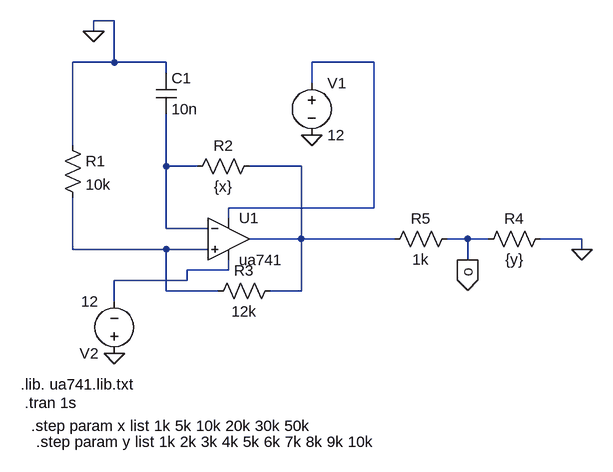
[diagram p0: schematic Square wave.asc]
Square wave.asc, the LTspice schematic file:
Version 4
SHEET 1 880 680
WIRE 48 -176 16 -176
WIRE 16 -160 16 -176
WIRE 48 -112 48 -176
WIRE 48 -112 -16 -112
WIRE 128 -112 48 -112
WIRE 448 -112 352 -112
WIRE 128 -96 128 -112
WIRE 352 -80 352 -112
WIRE -16 16 -16 -112
WIRE 128 48 128 -32
WIRE 176 48 128 48
WIRE 336 48 256 48
WIRE 448 112 448 -112
WIRE 448 112 224 112
WIRE 224 128 224 112
WIRE 128 144 128 48
WIRE 192 144 128 144
WIRE 336 160 336 48
WIRE 336 160 256 160
WIRE 480 160 336 160
WIRE 592 160 560 160
WIRE 624 160 592 160
WIRE 768 160 704 160
WIRE -16 176 -16 96
WIRE 128 176 -16 176
WIRE 192 176 128 176
WIRE 768 176 768 160
WIRE 592 192 592 160
WIRE 224 208 224 192
WIRE 224 208 160 208
WIRE 160 224 160 208
WIRE 160 224 48 224
WIRE 128 240 128 176
WIRE 208 240 128 240
WIRE 336 240 336 160
WIRE 336 240 288 240
WIRE 48 256 48 224
FLAG 16 -160 0
FLAG 48 336 0
FLAG 352 0 0
FLAG 768 176 0
FLAG 592 192 o
IOPIN 592 192 Out
SYMBOL res -32 0 R0
SYMATTR InstName R1
SYMATTR Value 10k
SYMBOL res 272 32 R90
WINDOW 0 0 56 VBottom 2
WINDOW 3 32 56 VTop 2
SYMATTR InstName R2
SYMATTR Value {x}
SYMBOL cap 112 -96 R0
SYMATTR InstName C1
SYMATTR Value 10n
SYMBOL res 304 224 R90
WINDOW 0 0 56 VBottom 2
WINDOW 3 32 56 VTop 2
SYMATTR InstName R3
SYMATTR Value 12k
SYMBOL voltage 352 -96 R0
WINDOW 123 0 0 Left 0
WINDOW 39 0 0 Left 0
SYMATTR InstName V1
SYMATTR Value 12
SYMBOL voltage 48 352 R180
WINDOW 123 0 0 Left 0
WINDOW 39 0 0 Left 0
SYMATTR InstName V2
SYMATTR Value 12
SYMBOL OpAmps\\ua741 224 96 R0
SYMATTR InstName U1
SYMBOL res 720 144 R90
WINDOW 0 0 56 VBottom 2
WINDOW 3 32 56 VTop 2
SYMATTR InstName R4
SYMATTR Value {y}
SYMBOL res 464 176 R270
WINDOW 0 32 56 VTop 2
WINDOW 3 0 56 VBottom 2
SYMATTR InstName R5
SYMATTR Value 1k
TEXT -90 412 Left 2 !.tran 1s
TEXT -96 384 Left 2 !.lib. ua741.lib.txt
TEXT -80 448 Left 2 !.step param x list 1k 5k 10k 20k 30k 50k
TEXT -72 472 Left 2 !.step param y list 1k 2k 3k 4k 5k 6k 7k 8k 9k 10k

The netlist it stands for:
* Square wave.asc
R1 0 N004 10k
R2 N003 N002 {x}
C1 0 N002 10n
R3 N003 N004 12k
V1 N001 0 12
V2 0 N005 12
XU1 N004 N002 N001 N005 N003 ua741  ; pins In+ In- V+ V- OUT
R4 0 o {y}
R5 N003 o 1k
.tran 1s
.lib. ua741.lib.txt
.step param x list 1k 5k 10k 20k 30k 50k
.step param y list 1k 2k 3k 4k 5k 6k 7k 8k 9k 10k
.backanno
.end